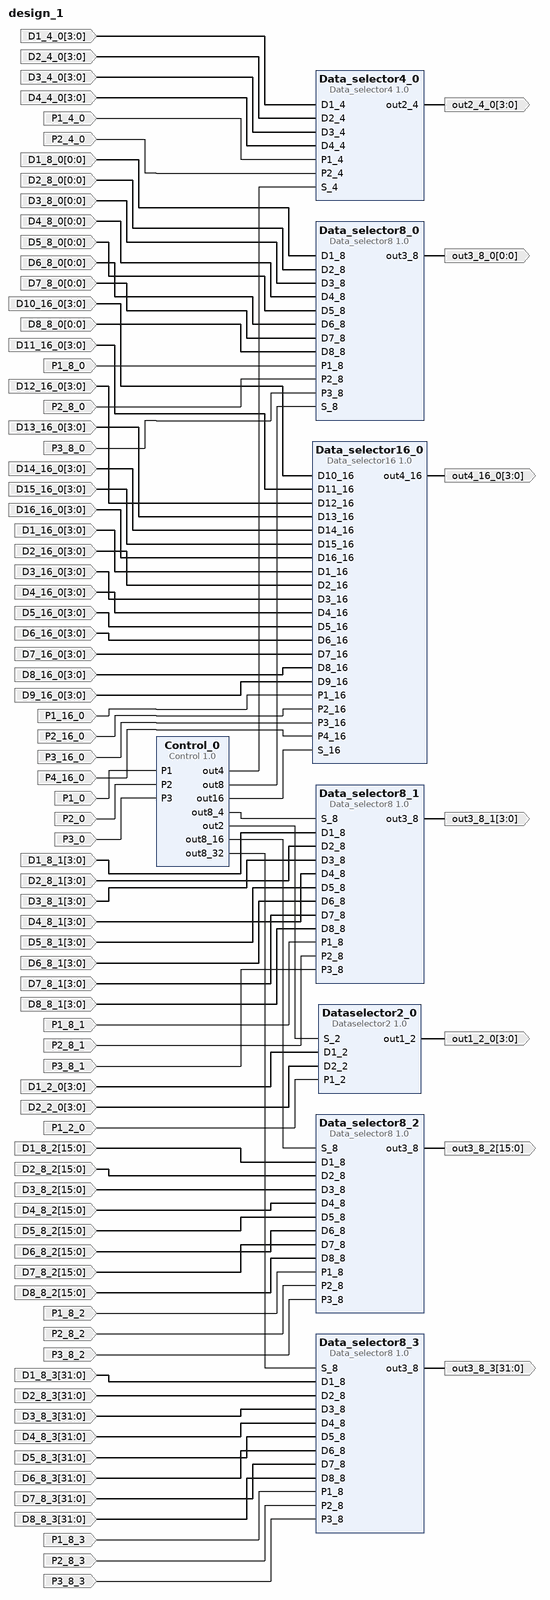
[diagram p0: block diagram of the top level]
# Vivado block design design_1, xc7a100tfgg484-1, Vivado 2017.4
create_bd_design design_1

create_bd_port -dir I -from 3 -to 0 D10_16_0
create_bd_port -dir I -from 3 -to 0 D11_16_0
create_bd_port -dir I -from 3 -to 0 D12_16_0
create_bd_port -dir I -from 3 -to 0 D13_16_0
create_bd_port -dir I -from 3 -to 0 D14_16_0
create_bd_port -dir I -from 3 -to 0 D15_16_0
create_bd_port -dir I -from 3 -to 0 D16_16_0
create_bd_port -dir I -from 3 -to 0 D1_16_0
create_bd_port -dir I -from 3 -to 0 D2_16_0
create_bd_port -dir I -from 3 -to 0 D3_16_0
create_bd_port -dir I -from 3 -to 0 D4_16_0
create_bd_port -dir I -from 3 -to 0 D5_16_0
create_bd_port -dir I -from 3 -to 0 D6_16_0
create_bd_port -dir I -from 3 -to 0 D7_16_0
create_bd_port -dir I -from 3 -to 0 D8_16_0
create_bd_port -dir I -from 3 -to 0 D9_16_0
create_bd_port -dir I P1_16_0
create_bd_port -dir I P2_16_0
create_bd_port -dir I P3_16_0
create_bd_port -dir I P4_16_0
create_bd_port -dir O -from 3 -to 0 out4_16_0
create_bd_port -dir I -from 3 -to 0 D1_2_0
create_bd_port -dir I -from 3 -to 0 D2_2_0
create_bd_port -dir I P1_2_0
create_bd_port -dir O -from 3 -to 0 out1_2_0
create_bd_port -dir I -from 3 -to 0 D1_4_0
create_bd_port -dir I -from 3 -to 0 D2_4_0
create_bd_port -dir I -from 3 -to 0 D3_4_0
create_bd_port -dir I -from 3 -to 0 D4_4_0
create_bd_port -dir I P1_4_0
create_bd_port -dir I P2_4_0
create_bd_port -dir O -from 3 -to 0 out2_4_0
create_bd_port -dir I -from 0 -to 0 D1_8_0
create_bd_port -dir I -from 0 -to 0 D2_8_0
create_bd_port -dir I -from 0 -to 0 D3_8_0
create_bd_port -dir I -from 0 -to 0 D4_8_0
create_bd_port -dir I -from 0 -to 0 D5_8_0
create_bd_port -dir I -from 0 -to 0 D6_8_0
create_bd_port -dir I -from 0 -to 0 D7_8_0
create_bd_port -dir I -from 0 -to 0 D8_8_0
create_bd_port -dir I P1_8_0
create_bd_port -dir I P2_8_0
create_bd_port -dir I P3_8_0
create_bd_port -dir O -from 0 -to 0 out3_8_0
create_bd_port -dir I -from 3 -to 0 D1_8_1
create_bd_port -dir I -from 3 -to 0 D2_8_1
create_bd_port -dir I -from 3 -to 0 D3_8_1
create_bd_port -dir I -from 3 -to 0 D4_8_1
create_bd_port -dir I -from 3 -to 0 D5_8_1
create_bd_port -dir I -from 3 -to 0 D6_8_1
create_bd_port -dir I -from 3 -to 0 D7_8_1
create_bd_port -dir I -from 3 -to 0 D8_8_1
create_bd_port -dir I P1_8_1
create_bd_port -dir I P2_8_1
create_bd_port -dir I P3_8_1
create_bd_port -dir O -from 3 -to 0 out3_8_1
create_bd_port -dir I -from 15 -to 0 D1_8_2
create_bd_port -dir I -from 15 -to 0 D2_8_2
create_bd_port -dir I -from 15 -to 0 D3_8_2
create_bd_port -dir I -from 15 -to 0 D4_8_2
create_bd_port -dir I -from 15 -to 0 D5_8_2
create_bd_port -dir I -from 15 -to 0 D6_8_2
create_bd_port -dir I -from 15 -to 0 D7_8_2
create_bd_port -dir I -from 15 -to 0 D8_8_2
create_bd_port -dir I P1_8_2
create_bd_port -dir I P2_8_2
create_bd_port -dir I P3_8_2
create_bd_port -dir O -from 15 -to 0 out3_8_2
create_bd_port -dir I -from 31 -to 0 D1_8_3
create_bd_port -dir I -from 31 -to 0 D2_8_3
create_bd_port -dir I -from 31 -to 0 D3_8_3
create_bd_port -dir I -from 31 -to 0 D4_8_3
create_bd_port -dir I -from 31 -to 0 D5_8_3
create_bd_port -dir I -from 31 -to 0 D6_8_3
create_bd_port -dir I -from 31 -to 0 D7_8_3
create_bd_port -dir I -from 31 -to 0 D8_8_3
create_bd_port -dir I P1_8_3
create_bd_port -dir I P2_8_3
create_bd_port -dir I P3_8_3
create_bd_port -dir O -from 31 -to 0 out3_8_3
create_bd_port -dir I P1_0
create_bd_port -dir I P2_0
create_bd_port -dir I P3_0

create_bd_cell -type ip -vlnv xilinx.com:user:Control:1.0 Control_0
create_bd_cell -type ip -vlnv xilinx.com:user:Dataselector2:1.0 Dataselector2_0
create_bd_cell -type ip -vlnv xilinx.com:user:Data_selector4:1.0 Data_selector4_0
create_bd_cell -type ip -vlnv xilinx.com:user:Data_selector8:1.0 Data_selector8_0
set_property -dict {CONFIG.WIDTH 1} [get_bd_cells Data_selector8_0]
create_bd_cell -type ip -vlnv xilinx.com:user:Data_selector8:1.0 Data_selector8_1
create_bd_cell -type ip -vlnv xilinx.com:user:Data_selector8:1.0 Data_selector8_2
set_property -dict {CONFIG.WIDTH 16} [get_bd_cells Data_selector8_2]
create_bd_cell -type ip -vlnv xilinx.com:user:Data_selector8:1.0 Data_selector8_3
set_property -dict {CONFIG.WIDTH 32} [get_bd_cells Data_selector8_3]
create_bd_cell -type ip -vlnv xilinx.com:user:Data_selector16:1.0 Data_selector16_0

# ---- connections ----

connect_bd_net [get_bd_pins Control_0/out2] [get_bd_pins Dataselector2_0/S_2]
connect_bd_net [get_bd_pins Control_0/out4] [get_bd_pins Data_selector4_0/S_4]
connect_bd_net [get_bd_pins Control_0/out8] [get_bd_pins Data_selector8_0/S_8]
connect_bd_net [get_bd_pins Control_0/out8_4] [get_bd_pins Data_selector8_1/S_8]
connect_bd_net [get_bd_pins Control_0/out8_16] [get_bd_pins Data_selector8_2/S_8]
connect_bd_net [get_bd_pins Control_0/out8_32] [get_bd_pins Data_selector8_3/S_8]
connect_bd_net [get_bd_pins Control_0/out16] [get_bd_pins Data_selector16_0/S_16]
connect_bd_net -net D10_16_0_1 [get_bd_ports D10_16_0] [get_bd_pins Data_selector16_0/D10_16]
connect_bd_net -net D11_16_0_1 [get_bd_ports D11_16_0] [get_bd_pins Data_selector16_0/D11_16]
connect_bd_net -net D12_16_0_1 [get_bd_ports D12_16_0] [get_bd_pins Data_selector16_0/D12_16]
connect_bd_net -net D13_16_0_1 [get_bd_ports D13_16_0] [get_bd_pins Data_selector16_0/D13_16]
connect_bd_net -net D14_16_0_1 [get_bd_ports D14_16_0] [get_bd_pins Data_selector16_0/D14_16]
connect_bd_net -net D15_16_0_1 [get_bd_ports D15_16_0] [get_bd_pins Data_selector16_0/D15_16]
connect_bd_net -net D16_16_0_1 [get_bd_ports D16_16_0] [get_bd_pins Data_selector16_0/D16_16]
connect_bd_net -net D1_16_0_1 [get_bd_ports D1_16_0] [get_bd_pins Data_selector16_0/D1_16]
connect_bd_net -net D2_16_0_1 [get_bd_ports D2_16_0] [get_bd_pins Data_selector16_0/D2_16]
connect_bd_net -net D3_16_0_1 [get_bd_ports D3_16_0] [get_bd_pins Data_selector16_0/D3_16]
connect_bd_net -net D4_16_0_1 [get_bd_ports D4_16_0] [get_bd_pins Data_selector16_0/D4_16]
connect_bd_net -net D5_16_0_1 [get_bd_ports D5_16_0] [get_bd_pins Data_selector16_0/D5_16]
connect_bd_net -net D6_16_0_1 [get_bd_ports D6_16_0] [get_bd_pins Data_selector16_0/D6_16]
connect_bd_net -net D7_16_0_1 [get_bd_ports D7_16_0] [get_bd_pins Data_selector16_0/D7_16]
connect_bd_net -net D8_16_0_1 [get_bd_ports D8_16_0] [get_bd_pins Data_selector16_0/D8_16]
connect_bd_net -net D9_16_0_1 [get_bd_ports D9_16_0] [get_bd_pins Data_selector16_0/D9_16]
connect_bd_net -net P1_16_0_1 [get_bd_ports P1_16_0] [get_bd_pins Data_selector16_0/P1_16]
connect_bd_net -net P2_16_0_1 [get_bd_ports P2_16_0] [get_bd_pins Data_selector16_0/P2_16]
connect_bd_net -net P3_16_0_1 [get_bd_ports P3_16_0] [get_bd_pins Data_selector16_0/P3_16]
connect_bd_net -net P4_16_0_1 [get_bd_ports P4_16_0] [get_bd_pins Data_selector16_0/P4_16]
connect_bd_net [get_bd_pins Data_selector16_0/out4_16] [get_bd_ports out4_16_0]
connect_bd_net -net D1_2_0_1 [get_bd_ports D1_2_0] [get_bd_pins Dataselector2_0/D1_2]
connect_bd_net -net D2_2_0_1 [get_bd_ports D2_2_0] [get_bd_pins Dataselector2_0/D2_2]
connect_bd_net -net P1_2_0_1 [get_bd_ports P1_2_0] [get_bd_pins Dataselector2_0/P1_2]
connect_bd_net [get_bd_pins Dataselector2_0/out1_2] [get_bd_ports out1_2_0]
connect_bd_net -net D1_4_0_1 [get_bd_ports D1_4_0] [get_bd_pins Data_selector4_0/D1_4]
connect_bd_net -net D2_4_0_1 [get_bd_ports D2_4_0] [get_bd_pins Data_selector4_0/D2_4]
connect_bd_net -net D3_4_0_1 [get_bd_ports D3_4_0] [get_bd_pins Data_selector4_0/D3_4]
connect_bd_net -net D4_4_0_1 [get_bd_ports D4_4_0] [get_bd_pins Data_selector4_0/D4_4]
connect_bd_net -net P1_4_0_1 [get_bd_ports P1_4_0] [get_bd_pins Data_selector4_0/P1_4]
connect_bd_net -net P2_4_0_1 [get_bd_ports P2_4_0] [get_bd_pins Data_selector4_0/P2_4]
connect_bd_net [get_bd_pins Data_selector4_0/out2_4] [get_bd_ports out2_4_0]
connect_bd_net -net D1_8_0_1 [get_bd_ports D1_8_0] [get_bd_pins Data_selector8_0/D1_8]
connect_bd_net -net D2_8_0_1 [get_bd_ports D2_8_0] [get_bd_pins Data_selector8_0/D2_8]
connect_bd_net -net D3_8_0_1 [get_bd_ports D3_8_0] [get_bd_pins Data_selector8_0/D3_8]
connect_bd_net -net D4_8_0_1 [get_bd_ports D4_8_0] [get_bd_pins Data_selector8_0/D4_8]
connect_bd_net -net D5_8_0_1 [get_bd_ports D5_8_0] [get_bd_pins Data_selector8_0/D5_8]
connect_bd_net -net D6_8_0_1 [get_bd_ports D6_8_0] [get_bd_pins Data_selector8_0/D6_8]
connect_bd_net -net D7_8_0_1 [get_bd_ports D7_8_0] [get_bd_pins Data_selector8_0/D7_8]
connect_bd_net -net D8_8_0_1 [get_bd_ports D8_8_0] [get_bd_pins Data_selector8_0/D8_8]
connect_bd_net -net P1_8_0_1 [get_bd_ports P1_8_0] [get_bd_pins Data_selector8_0/P1_8]
connect_bd_net -net P2_8_0_1 [get_bd_ports P2_8_0] [get_bd_pins Data_selector8_0/P2_8]
connect_bd_net -net P3_8_0_1 [get_bd_ports P3_8_0] [get_bd_pins Data_selector8_0/P3_8]
connect_bd_net [get_bd_pins Data_selector8_0/out3_8] [get_bd_ports out3_8_0]
connect_bd_net -net D1_8_1_1 [get_bd_ports D1_8_1] [get_bd_pins Data_selector8_1/D1_8]
connect_bd_net -net D2_8_1_1 [get_bd_ports D2_8_1] [get_bd_pins Data_selector8_1/D2_8]
connect_bd_net -net D3_8_1_1 [get_bd_ports D3_8_1] [get_bd_pins Data_selector8_1/D3_8]
connect_bd_net -net D4_8_1_1 [get_bd_ports D4_8_1] [get_bd_pins Data_selector8_1/D4_8]
connect_bd_net -net D5_8_1_1 [get_bd_ports D5_8_1] [get_bd_pins Data_selector8_1/D5_8]
connect_bd_net -net D6_8_1_1 [get_bd_ports D6_8_1] [get_bd_pins Data_selector8_1/D6_8]
connect_bd_net -net D7_8_1_1 [get_bd_ports D7_8_1] [get_bd_pins Data_selector8_1/D7_8]
connect_bd_net -net D8_8_1_1 [get_bd_ports D8_8_1] [get_bd_pins Data_selector8_1/D8_8]
connect_bd_net -net P1_8_1_1 [get_bd_ports P1_8_1] [get_bd_pins Data_selector8_1/P1_8]
connect_bd_net -net P2_8_1_1 [get_bd_ports P2_8_1] [get_bd_pins Data_selector8_1/P2_8]
connect_bd_net -net P3_8_1_1 [get_bd_ports P3_8_1] [get_bd_pins Data_selector8_1/P3_8]
connect_bd_net [get_bd_pins Data_selector8_1/out3_8] [get_bd_ports out3_8_1]
connect_bd_net -net D1_8_2_1 [get_bd_ports D1_8_2] [get_bd_pins Data_selector8_2/D1_8]
connect_bd_net -net D2_8_2_1 [get_bd_ports D2_8_2] [get_bd_pins Data_selector8_2/D2_8]
connect_bd_net -net D3_8_2_1 [get_bd_ports D3_8_2] [get_bd_pins Data_selector8_2/D3_8]
connect_bd_net -net D4_8_2_1 [get_bd_ports D4_8_2] [get_bd_pins Data_selector8_2/D4_8]
connect_bd_net -net D5_8_2_1 [get_bd_ports D5_8_2] [get_bd_pins Data_selector8_2/D5_8]
connect_bd_net -net D6_8_2_1 [get_bd_ports D6_8_2] [get_bd_pins Data_selector8_2/D6_8]
connect_bd_net -net D7_8_2_1 [get_bd_ports D7_8_2] [get_bd_pins Data_selector8_2/D7_8]
connect_bd_net -net D8_8_2_1 [get_bd_ports D8_8_2] [get_bd_pins Data_selector8_2/D8_8]
connect_bd_net -net P1_8_2_1 [get_bd_ports P1_8_2] [get_bd_pins Data_selector8_2/P1_8]
connect_bd_net -net P2_8_2_1 [get_bd_ports P2_8_2] [get_bd_pins Data_selector8_2/P2_8]
connect_bd_net -net P3_8_2_1 [get_bd_ports P3_8_2] [get_bd_pins Data_selector8_2/P3_8]
connect_bd_net [get_bd_pins Data_selector8_2/out3_8] [get_bd_ports out3_8_2]
connect_bd_net -net D1_8_3_1 [get_bd_ports D1_8_3] [get_bd_pins Data_selector8_3/D1_8]
connect_bd_net -net D2_8_3_1 [get_bd_ports D2_8_3] [get_bd_pins Data_selector8_3/D2_8]
connect_bd_net -net D3_8_3_1 [get_bd_ports D3_8_3] [get_bd_pins Data_selector8_3/D3_8]
connect_bd_net -net D4_8_3_1 [get_bd_ports D4_8_3] [get_bd_pins Data_selector8_3/D4_8]
connect_bd_net -net D5_8_3_1 [get_bd_ports D5_8_3] [get_bd_pins Data_selector8_3/D5_8]
connect_bd_net -net D6_8_3_1 [get_bd_ports D6_8_3] [get_bd_pins Data_selector8_3/D6_8]
connect_bd_net -net D7_8_3_1 [get_bd_ports D7_8_3] [get_bd_pins Data_selector8_3/D7_8]
connect_bd_net -net D8_8_3_1 [get_bd_ports D8_8_3] [get_bd_pins Data_selector8_3/D8_8]
connect_bd_net -net P1_8_3_1 [get_bd_ports P1_8_3] [get_bd_pins Data_selector8_3/P1_8]
connect_bd_net -net P2_8_3_1 [get_bd_ports P2_8_3] [get_bd_pins Data_selector8_3/P2_8]
connect_bd_net -net P3_8_3_1 [get_bd_ports P3_8_3] [get_bd_pins Data_selector8_3/P3_8]
connect_bd_net [get_bd_pins Data_selector8_3/out3_8] [get_bd_ports out3_8_3]
connect_bd_net -net P1_0_1 [get_bd_ports P1_0] [get_bd_pins Control_0/P1]
connect_bd_net -net P2_0_1 [get_bd_ports P2_0] [get_bd_pins Control_0/P2]
connect_bd_net -net P3_0_1 [get_bd_ports P3_0] [get_bd_pins Control_0/P3]

validate_bd_design
save_bd_design
